# Altium schematic sheet MCU.SchDoc
size A; SheetNumber: 1; SheetTotal: 3
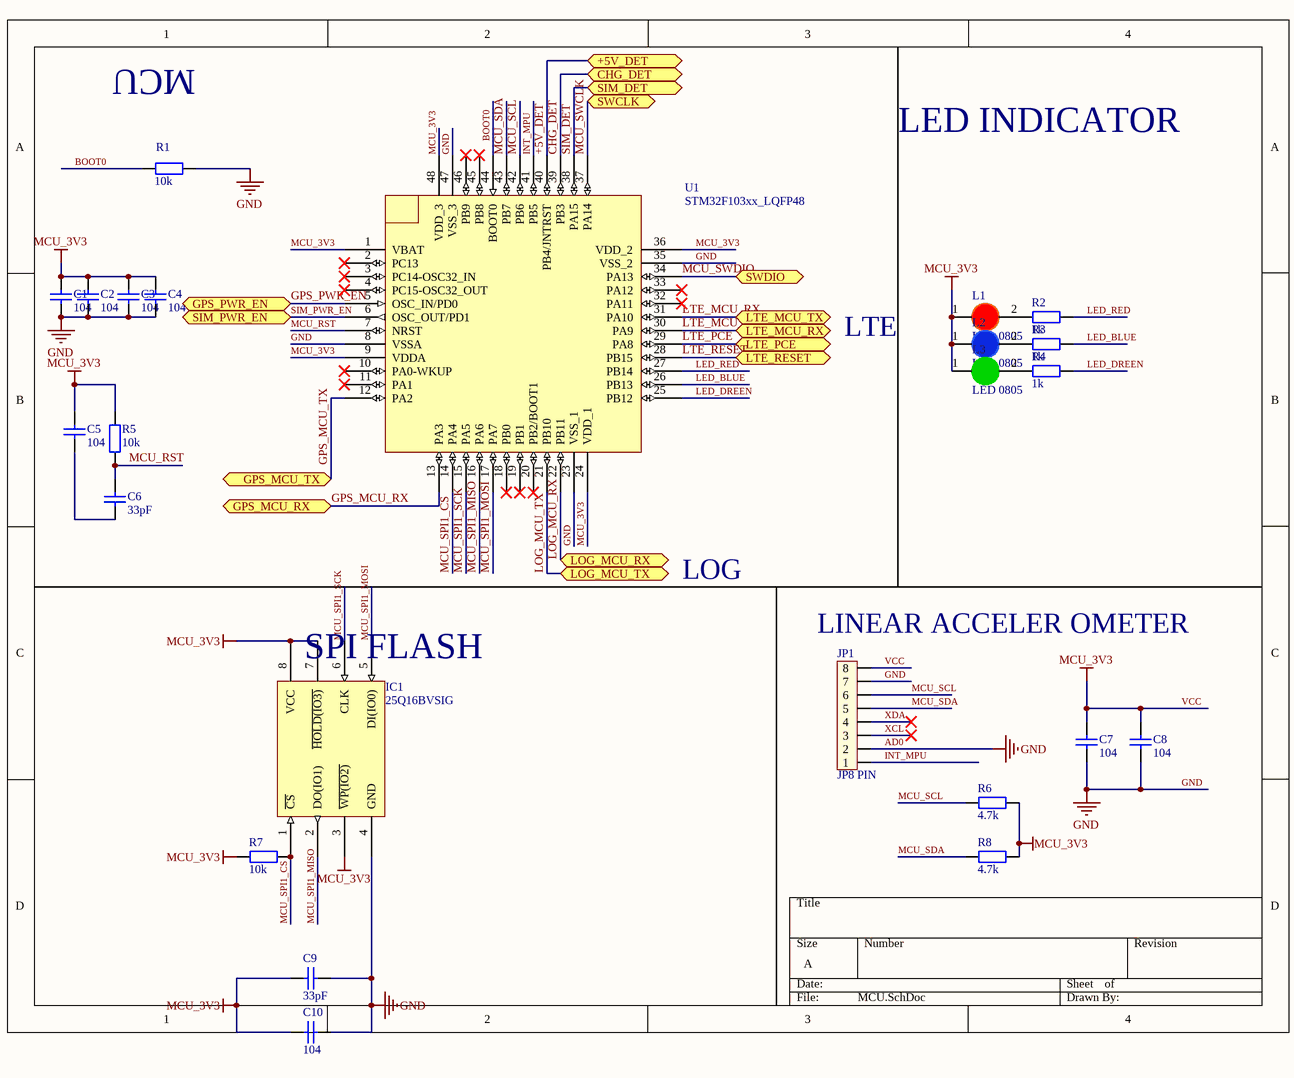
[diagram p0: MCU.SchDoc]

## Parts
C1  104  [tu 0805]
C2  104  [tu 0805]
C3  104  [tu 0805]
C4  104  [tu 0805]
C5  104  [tu 0805]
C6  33pF  [tu 0805]
C7  104  [tu 0805]
C8  104  [tu 0805]
C9  33pF  [tu 0805]
C10  104  [tu 0805]
IC1  25Q16BVSIG  [SOP127P790X195-8N]
JP1  JP8 PIN  [JP8]
L1  LED 0805  [LED-0805-Red]
L2  LED 0805  [LED-0805-Blue]
L3  LED 0805  [LED-0805-Green]
R1  10k  [tro smd 0805]
R2  1k  [tro smd 0805]
R3  1k  [tro smd 0805]
R4  1k  [tro smd 0805]
R5  10k  [tro smd 0805]
R6  4.7k  [tro smd 0805]
R7  10k  [tro smd 0805]
R8  4.7k  [tro smd 0805]
U1  STM32F103xx_LQFP48  [STM32_LQPF48]

## Ports
+5V_DET (bidir), CHG_DET (bidir), GPS_MCU_RX (bidir), GPS_MCU_TX (bidir), GPS_PWR_EN (bidir), LOG_MCU_RX (bidir), LOG_MCU_TX (bidir), LTE_MCU_RX (bidir), LTE_MCU_TX (bidir), LTE_PCE (bidir), LTE_RESET (bidir), SIM_DET (bidir), SIM_PWR_EN (bidir), SWCLK (bidir), SWDIO (bidir)

## Nets
AD0: C1.1 C2.1 C3.1 C4.1 C7.1 C8.1 C9.2 C10.1 IC1.4(GND) JP1.2 JP1.7 R1.1 U1.8(VSSA) U1.23(VSS_1) U1.35(VSS_2) U1.47(VSS_3)  [also labelled GND]
MCU_3V3: C1.2 C2.2 C3.2 C4.2 C5.2 C7.2 C8.2 C9.1 C10.2 IC1.3(~{WP(IO2)}) IC1.7(~{HOLD(IO3)}) IC1.8(VCC) JP1.8 L1.1(A) L2.1(A) L3.1(A) R5.2 R6.2 R7.2 R8.2 U1.1(VBAT) U1.9(VDDA) U1.24(VDD_1) U1.36(VDD_2) U1.48(VDD_3)  [also labelled VCC]
+5V_DET: U1.40(PB4/JNTRST) ; port +5V_DET
BOOT0: R1.2 U1.44(BOOT0)
CHG_DET: U1.39(PB3) ; port CHG_DET
GPS_MCU_RX: U1.13(PA3) ; port GPS_MCU_RX
GPS_MCU_TX: U1.12(PA2) ; port GPS_MCU_TX
GPS_PWR_EN: U1.5(OSC_IN/PD0) ; port GPS_PWR_EN
INT_MPU: JP1.1 U1.41(PB5)
LED_BLUE: R3.2 U1.26(PB13)
LED_DREEN: R4.2 U1.25(PB12)
LED_RED: R2.2 U1.27(PB14)
LOG_MCU_RX: U1.22(PB11) ; port LOG_MCU_RX
LOG_MCU_TX: U1.21(PB10) ; port LOG_MCU_TX
LTE_MCU_RX: U1.31(PA10) ; port LTE_MCU_TX
LTE_MCU_TX: U1.30(PA9) ; port LTE_MCU_RX
LTE_PCE: U1.29(PA8) ; port LTE_PCE
LTE_RESET: U1.28(PB15) ; port LTE_RESET
MCU_RST: C6.1 R5.1 U1.7(NRST)
MCU_SCL: JP1.6 R6.1 U1.42(PB6)
MCU_SDA: JP1.5 R8.1 U1.43(PB7)
MCU_SPI1_CS: IC1.1(~{CS}) R7.1 U1.14(PA4)
MCU_SPI1_MISO: IC1.2(DO(IO1)) U1.16(PA6)
MCU_SPI1_MOSI: IC1.5(DI(IO0)) U1.17(PA7)
MCU_SPI1_SCK: IC1.6(CLK) U1.15(PA5)
MCU_SWCLK: U1.37(PA14) ; port SWCLK
MCU_SWDIO: U1.34(PA13) ; port SWDIO
SIM_DET: U1.38(PA15) ; port SIM_DET
SIM_PWR_EN: U1.6(OSC_OUT/PD1) ; port SIM_PWR_EN
XCL: JP1.3
XDA: JP1.4
NetC5_1: C5.1 C6.2
NetL1_2: L1.2(K) R2.1
NetL2_2: L2.2(K) R3.1
NetL3_2: L3.2(K) R4.1

Not connected (* = marked no-connect by the designer): U1 2(PC13)* 3(PC14-OSC32_IN)* 4(PC15-OSC32_OUT)* 10(PA0-WKUP)* 11(PA1)* 18(PB0)* 19(PB1)* 20(PB2/BOOT1)* 32(PA11)* 33(PA12)* 45(PB8)* 46(PB9)*

## Notes on the sheet
- MCU
- LED INDICATOR
- LTE
- LOG
- (near JP1) LINEAR ACCELER OMETER
- (near IC1) SPI FLASH

## Library data of the parts
C1-C5 C7 C8 C10 = Tu 0805 104 50V 10%: Dán; Don_Vi: Con; So_Chan: 2; Ten_Linh_Kien: Tụ 0805 104-100nF 10% 50V; Ma_Hang: MH004551; Chung_Loai: Dán; Kieu_Chan: *
C6 C9 = Tu 0805 33pF 50V 10%: Dán; Don_Vi: Con; So_Chan: 2; Ten_Linh_Kien: Tụ 0805 33p 10% 50V; Ma_Hang: MH004563; Chung_Loai: Dán; Kieu_Chan: *
JP1 = JP8: Value: JP7
L1 = LED 0805 Do: Dán; Don_Vi: Con; Ma_Hang: MH000897; Ten_Linh_Kien: LED 0805 Màu Đỏ (Red); Ghi_Chu: *; Kieu_Chan: *; Chung_Loai: Dán
L2 = LED 0805 Xanh Duong: Dán; Don_Vi: Con; Ma_Hang: MH002327; Ten_Linh_Kien: LED 0805 Màu Xanh Dương (Blue); Ghi_Chu: *; Kieu_Chan: *; Chung_Loai: Dán
L3 = LED 0805 Xanh La: Dán; Don_Vi: Con; Ma_Hang: MH002326; Ten_Linh_Kien: LED 0805 Màu Xanh Lá (Green); Ghi_Chu: *; Kieu_Chan: *; Chung_Loai: Dán
R1 R5 R7 = Tro 0805 5% 10k: Dán; Don_Vi: Con; So_Chan: 2; Ten_Linh_Kien: Trở 0805 5% 10k; Ma_Hang: MH005239; Chung_Loai: Dán; Kieu_Chan: *
R2-R4 = Tro 0805 5% 1k: Dán; Don_Vi: Con; So_Chan: 2; Ten_Linh_Kien: Trở 0805 5% 1k; Ma_Hang: MH005234; Chung_Loai: Dán; Kieu_Chan: *
R6 R8 = Tro 0805 5% 4.7k: Dán; Don_Vi: Con; So_Chan: 2; Ten_Linh_Kien: Trở 0805 5% 4.7k; Ma_Hang: MH005307; Chung_Loai: Dán; Kieu_Chan: *
U1 = STM32F103xx_LQFP48: Published: 30-May-2008; DatasheetVersion: rev6, Mar-2008; PackageVersion: Mar-2008; PackageReference: LQFP48; Publisher: Altium Limited; PackageDescription: 48-Pin Low-Profile Quad Flat Pack, 7 x 7 mm Body, 0.5 mm Pitch (LQFP48); ComponentLink1Description: Manufacturer Link; ComponentLink1URL: www.st.com/stm32; ComponentLink2Description: Datasheet; ComponentLink2URL: http://www.st.com/stonline/products/literature/ds/13587.pdf